# EAGLE design Adapter Board (EAGLE 7.1.0)
eDP video adapter board
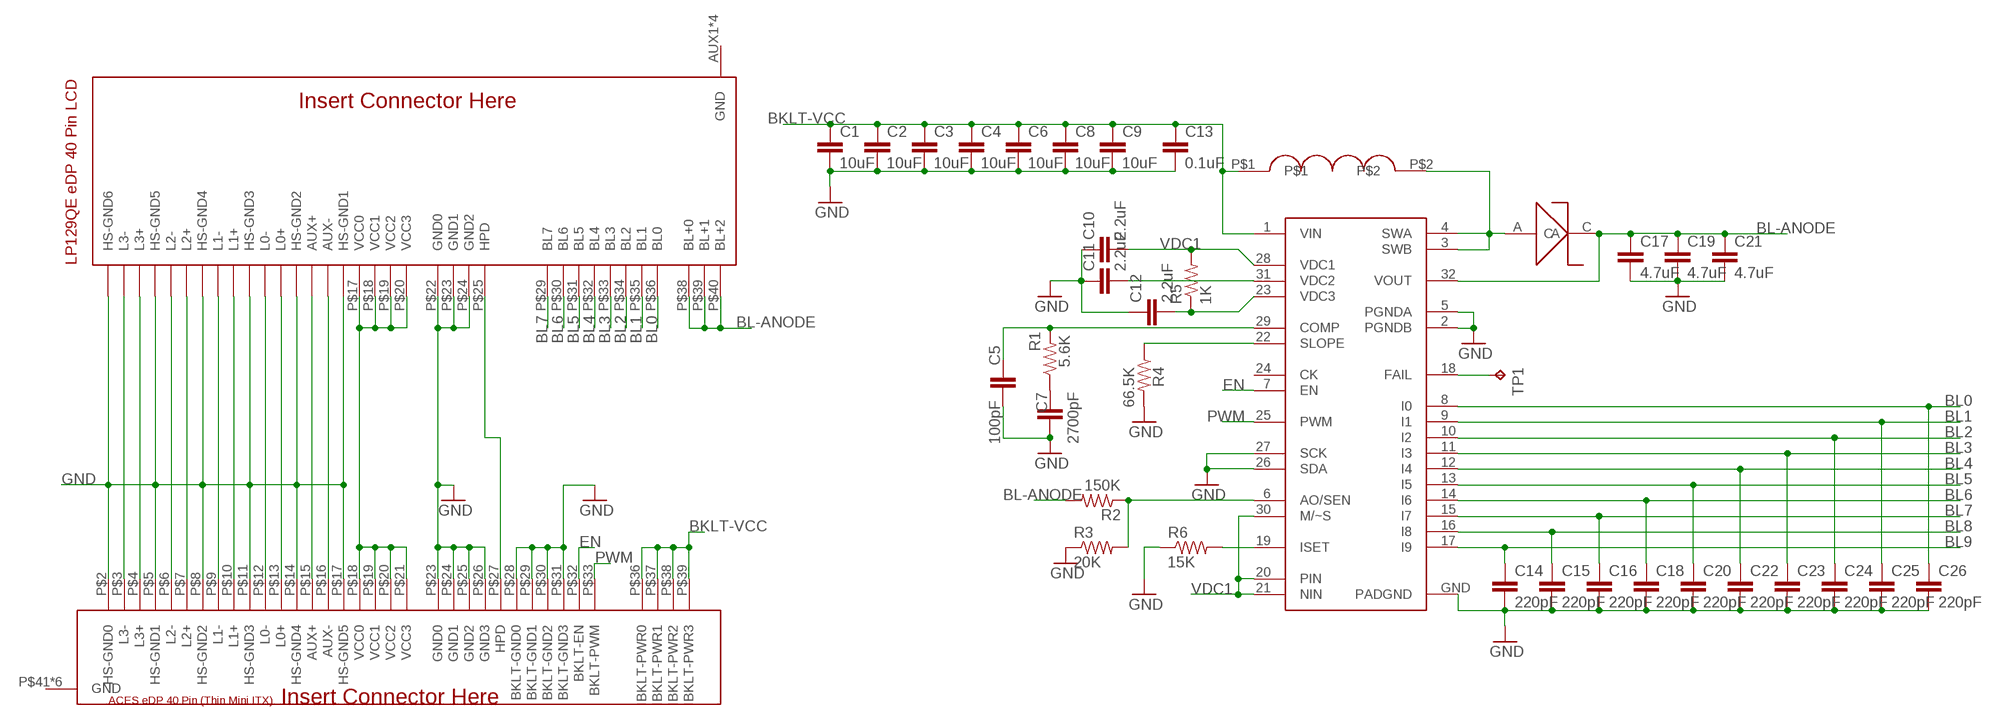
[diagram p0: schematic, sheet 1]

## Parts
C1  10uF  10UF-6.3V-20%(1206)  [1206]
C2  10uF  10UF-6.3V-20%(1206)  [1206]
C3  10uF  10UF-6.3V-20%(1206)  [1206]
C4  10uF  10UF-6.3V-20%(1206)  [1206]
C5  100pF  CAP0805  [0805]
C6  10uF  10UF-6.3V-20%(1206)  [1206]
C7  2700pF  CAP0805  [0805]
C8  10uF  10UF-6.3V-20%(1206)  [1206]
C9  10uF  10UF-6.3V-20%(1206)  [1206]
C10  2.2uF  CAP0805  [0805]
C11  2.2uF  CAP0805  [0805]
C12  2.2uF  CAP0805  [0805]
C13  0.1uF  CAP0805  [0805]
C14  220pF  CAP0805  [0805]
C15  220pF  CAP0805  [0805]
C16  220pF  CAP0805  [0805]
C17  4.7uF  CAP0805  [0805]
C18  220pF  CAP0805  [0805]
C19  4.7uF  CAP0805  [0805]
C20  220pF  CAP0805  [0805]
C21  4.7uF  CAP0805  [0805]
C22  220pF  CAP0805  [0805]
C23  220pF  CAP0805  [0805]
C24  220pF  CAP0805  [0805]
C25  220pF  CAP0805  [0805]
C26  220pF  CAP0805  [0805]
D1  SK38A-DIODE  [SK38A-DIODE]
F1  EDP-40PIN-ACES  [ACES-50203-040]
F2  LP129QE-EDP-40  [I-PEX-20474-040E-12]
I1  ASPI-8040S-INCUCTOR  [INDUCTOR]
R1  5.6K  RESISTOR0805-RES  [0805]
R2  150K  RESISTOR0805-RES  [0805]
R3  20K  RESISTOR0805-RES  [0805]
R4  66.5K  RESISTOR0805-RES  [0805]
R5  1K  RESISTOR0805-RES  [0805]
R6  15K  RESISTOR0805-RES  [0805]
TP1  TPTP15R  [TP15R]
U1  MC34844-LED-DRIVER  [QFN32]

## Nets
BKLT-VCC: C1.1 C2.1 C3.1 C4.1 C6.1 C8.1 C9.1 C13.1 F1.P$36(BKLT-PWR0) F1.P$37(BKLT-PWR1) F1.P$38(BKLT-PWR2) F1.P$39(BKLT-PWR3) I1.P$1 U1.1(VIN)
BL0: C26.1 F2.P$36(BL0) U1.8(I0)
BL1: C25.1 F2.P$35(BL1) U1.9(I1)
BL2: C24.1 F2.P$34(BL2) U1.10(I2)
BL3: C23.1 F2.P$33(BL3) U1.11(I3)
BL4: C22.1 F2.P$32(BL4) U1.12(I4)
BL5: C20.1 F2.P$31(BL5) U1.13(I5)
BL6: C18.1 F2.P$30(BL6) U1.14(I6)
BL7: C16.1 F2.P$29(BL7) U1.15(I7)
BL8: C15.1 U1.16(I8)
BL9: C14.1 U1.17(I9)
BL-ANODE: C17.1 C19.1 C21.1 D1.C F2.P$38(BL+0) F2.P$39(BL+1) F2.P$40(BL+2) R2.2 U1.32(VOUT)
EN: F1.P$32(BKLT-EN) U1.7(EN)
GND: C1.2 C2.2 C3.2 C4.2 C5.2 C6.2 C7.2 C8.2 C9.2 C10.1 C11.1 C12.1 C13.2 C14.2 C15.2 C16.2 C17.2 C18.2 C19.2 C20.2 C21.2 C22.2 C23.2 C24.2 C25.2 C26.2 F1.P$2(HS-GND0) F1.P$5(HS-GND1) F1.P$8(HS-GND2) F1.P$11(HS-GND3) F1.P$14(HS-GND4) F1.P$17(HS-GND5) F1.P$23(GND0) F1.P$24(GND1) F1.P$25(GND2) F1.P$26(GND3) F1.P$28(BKLT-GND0) F1.P$29(BKLT-GND1) F1.P$30(BKLT-GND2) F1.P$31(BKLT-GND3) F2.P$1(HS-GND6) F2.P$4(HS-GND5) F2.P$7(HS-GND4) F2.P$10(HS-GND3) F2.P$13(HS-GND2) F2.P$16(HS-GND1) F2.P$22(GND0) F2.P$23(GND1) F2.P$24(GND2) R3.1 R4.2 R6.1 U1.2(PGNDB) U1.5(PGNDA) U1.26(SDA) U1.27(SCK) U1.GND(PADGND)
HPD: F1.P$27(HPD) F2.P$25(HPD)
N$1: C5.1 R1.2 U1.29(COMP)
N$2: F1.P$3(L3-) F2.P$2(L3-)
N$3: F1.P$4(L3+) F2.P$3(L3+)
N$4: C11.2 U1.31(VDC2)
N$5: F1.P$6(L2-) F2.P$5(L2-)
N$6: F1.P$7(L2+) F2.P$6(L2+)
N$8: F1.P$9(L1-) F2.P$8(L1-)
N$9: F1.P$10(L1+) F2.P$9(L1+)
N$10: C12.2 R5.1 U1.23(VDC3)
N$11: F1.P$12(L0-) F2.P$11(L0-)
N$12: F1.P$13(L0+) F2.P$12(L0+)
N$13: C7.1 R1.1
N$14: F1.P$15(AUX+) F2.P$14(AUX+)
N$15: F1.P$16(AUX-) F2.P$15(AUX-)
N$16: R2.1 R3.2 U1.6(AO/SEN)
N$17: R4.1 U1.22(SLOPE)
N$18: TP1.TP U1.18(FAIL)
N$20: R6.2 U1.19(ISET)
PNL-VCC: F1.P$18(VCC0) F1.P$19(VCC1) F1.P$20(VCC2) F1.P$21(VCC3) F2.P$17(VCC0) F2.P$18(VCC1) F2.P$19(VCC2) F2.P$20(VCC3)
PWM: F1.P$33(BKLT-PWM) U1.25(PWM)
SWA/B: D1.A I1.P$2 U1.3(SWB) U1.4(SWA)
VDC1: C10.2 R5.2 U1.20(PIN) U1.21(NIN) U1.28(VDC1) U1.30(M/~S)
Unconnected: U1.24(CK)

## Power pins joined to a net without a drawn wire
GND: F1.P$41(GND) F1.P$42(GND) F1.P$43(GND) F1.P$44(GND) F1.P$45(GND) F1.P$46(GND) F2.AUX1(GND) F2.AUX2(GND) F2.GND-PAD1(GND) F2.GND-PAD2(GND)

## Library data of the parts
C1-C4 C6 C8 C9 = SparkFun-Capacitors:10UF-6.3V-20%(1206): Ceramic CAP-10057; PROD_ID: CAP-10057
C5 C7 C10-C13 C17 C19 C21 = SparkFun-Capacitors:CAP: Capacitor Standard 0603 ceramic capacitor, and 0.1" leaded capacitor.
C14-C16 C18 C20 C22-C26 = SparkFun-Passives:CAP: Capacitor Standard 0603 ceramic capacitor, and 0.1" leaded capacitor.
D1 = LCD Connectors:SK38A-DIODE
F1 = LCD Connectors:EDP-40PIN-ACES
F2 = LCD Connectors:LP129QE-EDP-40
I1 = LCD Connectors:ASPI-8040S-INCUCTOR
R1-R6 = SparkFun-Resistors:RESISTOR: Resistor Basic schematic elements and footprints for 0603, 1206, and PTH resistors.
TP1 = testpad:TP: Test pad
U1 = LCD Connectors:MC34844-LED-DRIVER

## Board
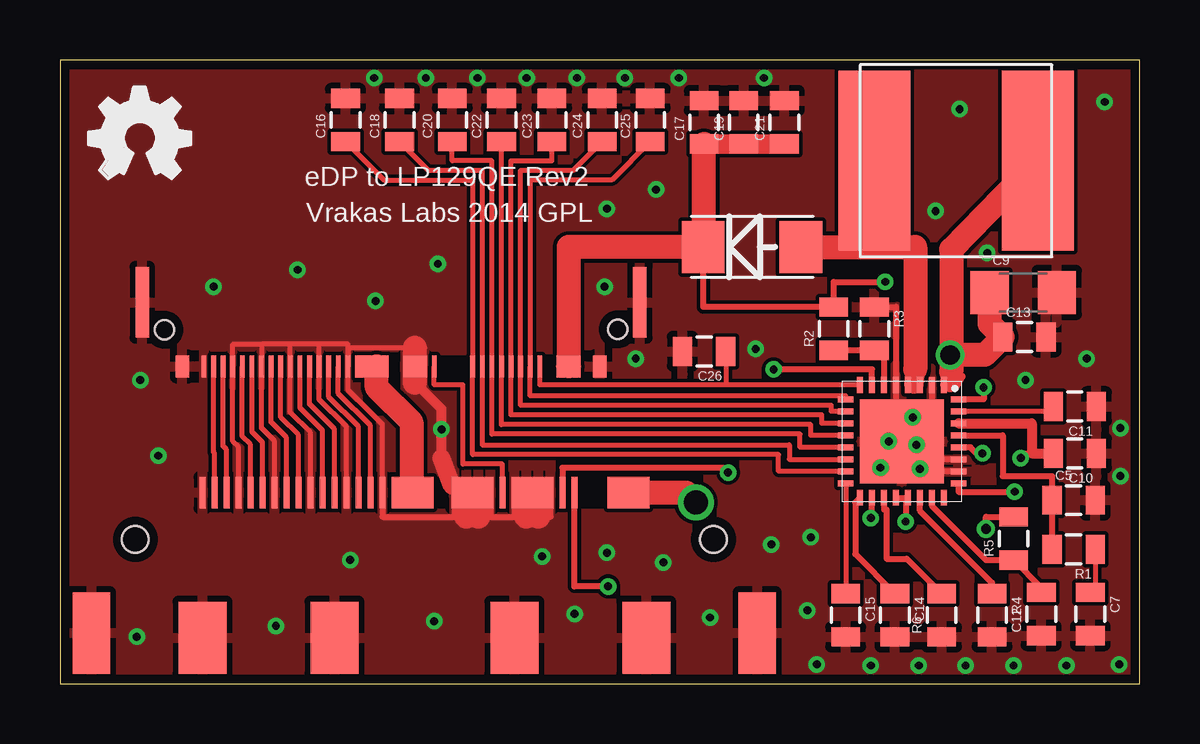
[diagram p1: board, top side]
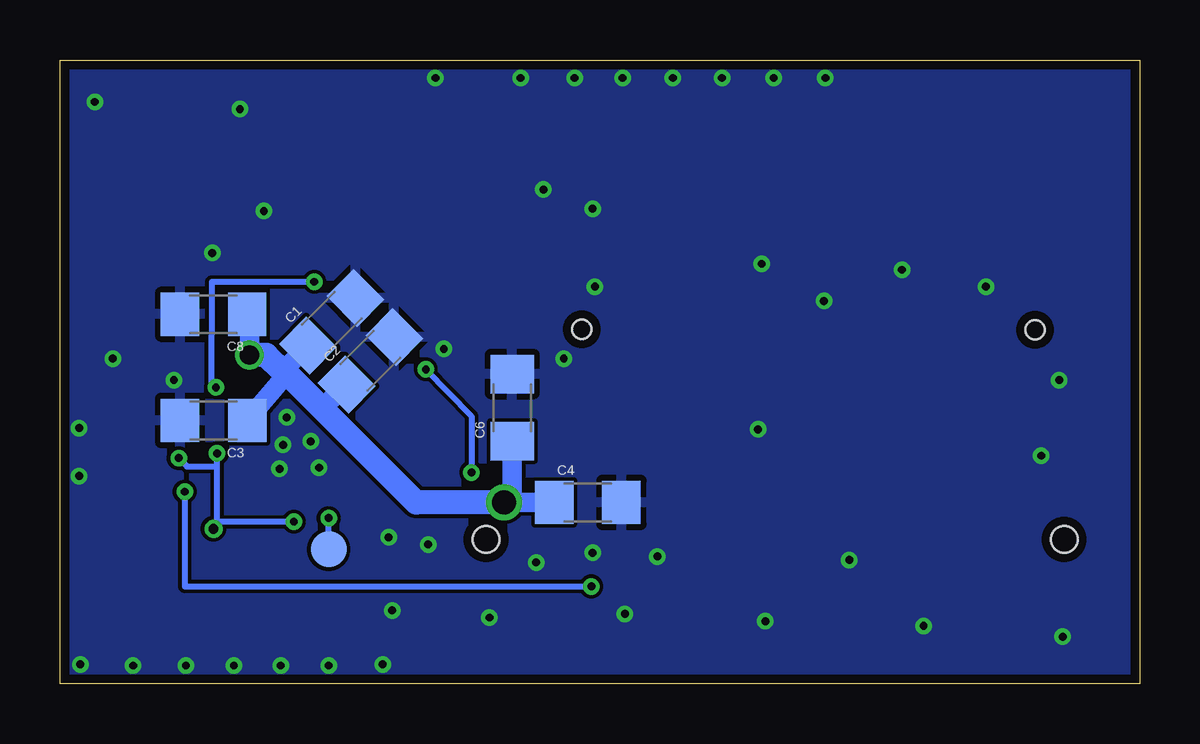
[diagram p2: board, bottom side, seen from below]

Size 45 x 26 mm. Coordinates in mm from the lower left corner, seen from the top.
Outline: 0,0 45,0 45,26 0,26 0,0
Copper layers (1*16): Top 0.0356mm / dielectric 1.5011mm / Bottom 0.0356mm
Design rules "oshpark-2layer": minimum track width 6mil, minimum drill 13mil, track to track 6mil, track to pad 6mil, pad to pad 6mil, via to via 6mil, smd to smd 6mil, copper to edge 15mil, drill to drill 6mil, minimum pad ring 7mil, minimum via ring 7mil, stop-mask expansion 4mil, vias tented up to drill 0mil, thermal gap 10mil

### Footprints (pad centres in the part's own frame; a part is rotated, then mirrored left to right if it is on the bottom)
1206 = smd 1.6 x 1.8: 1 -1.4,0; 2 1.4,0
0805 = smd 0.8 x 1.2: 1 -0.9,0; 2 0.9,0
SK38A-DIODE = smd 1.778 x 2.159: A -2.032,0; C 2.032,0
ACES-50203-040 = smd 0.25 x 1.3: P$2 -9.25,-0.65; P$3 -8.75,-0.65; P$4 -8.25,-0.65; P$5 -7.75,-0.65; P$6 -7.25,-0.65; P$7 -6.75,-0.65; P$8 -6.25,-0.65; P$9 -5.75,-0.65; P$10 -5.25,-0.65; P$11 -4.75,-0.65; P$12 -4.25,-0.65; P$13 -3.75,-0.65; P$14 -3.25,-0.65; P$15 -2.75,-0.65; P$16 -2.25,-0.65; P$17 -1.75,-0.65; P$18 -1.25,-0.65; P$21 0.25,-0.65; P$23 1.25,-0.65; P$26 2.75,-0.65; P$27 3.25,-0.65; P$28 3.75,-0.65; P$31 5.25,-0.65; P$32 5.75,-0.65; P$33 6.25,-0.65; P$36 7.75,-0.65; P$39 9.25,-0.65 | smd 1.25 x 1.3: P$19 -0.75,-0.65; P$20 -0.25,-0.65; P$24 1.75,-0.65; P$25 2.25,-0.65; P$29 4.25,-0.65; P$30 4.75,-0.65; P$37 8.25,-0.65; P$38 8.75,-0.65 | smd 1.55 x 3.4: P$41 -13.875,-6.5; P$42 13.875,-6.5 | smd 2 x 3: P$43 -9.25,-6.7; P$44 -3.75,-6.7; P$45 3.75,-6.7; P$46 9.25,-6.7 | hole 1.1: 12.05,-2.6; -12.05,-2.6
I-PEX-20474-040E-12 = smd 0.55 x 0.9: AUX1 0.8,0; AUX2 -16.6,0 | smd 0.56 x 2.95: GND-PAD1 -18.27,-2.675; GND-PAD2 2.47,-2.675 | smd 0.2 x 0.9: P$1 -0.1,0; P$2 -0.5,0; P$3 -0.9,0; P$4 -1.3,0; P$5 -1.7,0; P$6 -2.1,0; P$7 -2.5,0; P$8 -2.9,0; P$9 -3.3,0; P$10 -3.7,0; P$11 -4.1,0; P$12 -4.5,0; P$13 -4.9,0; P$14 -5.3,0; P$15 -5.7,0; P$16 -6.1,0; P$17 -6.5,0; P$20 -7.7,0; P$22 -8.5,0; P$24 -9.3,0; P$25 -9.7,0; P$29 -11.3,0; P$30 -11.7,0; P$31 -12.1,0; P$32 -12.5,0; P$33 -12.9,0; P$34 -13.3,0; P$35 -13.7,0; P$36 -14.1,0; P$38 -14.9,0; P$40 -15.7,0 | smd 1 x 0.9: P$18 -6.9,0; P$19 -7.3,0; P$23 -8.9,0; P$39 -15.3,0 | hole 0.8: 1.55,-1.53; -17.35,-1.55
INDUCTOR = smd 3 x 7.5: P$1 3.4,0; P$2 -3.4,0
TP15R = smd 1.5 x 1.5: TP 0,0
QFN32 = smd 0.65 x 0.25: 1 -2.35,1.75; 2 -2.35,1.25; 3 -2.35,0.75; 4 -2.35,0.25; 5 -2.35,-0.25; 6 -2.35,-0.75; 7 -2.35,-1.25; 8 -2.35,-1.75; 17 2.35,-1.75; 18 2.35,-1.25; 19 2.35,-0.75; 20 2.35,-0.25; 21 2.35,0.25; 22 2.35,0.75; 23 2.35,1.25; 24 2.35,1.75 | smd 0.25 x 0.65: 9 -1.75,-2.35; 10 -1.25,-2.35; 11 -0.75,-2.35; 12 -0.25,-2.35; 13 0.25,-2.35; 14 0.75,-2.35; 15 1.25,-2.35; 16 1.75,-2.35; 25 1.75,2.35; 26 1.25,2.35; 27 0.75,2.35; 28 0.25,2.35; 29 -0.25,2.35; 30 -0.75,2.35; 31 -1.25,2.35; 32 -1.75,2.35 | smd 3.5 x 3.5: GND 0,0

### Placement (x,y rotation side)
C1  33.67,15.09 45 bottom
C2  32.06,13.46 45 bottom
C3  38.59,10.97 180 bottom
C4  23,7.55 0 bottom
C5  42.25,7.65 0 top
C6  26.15,11.5 90 bottom
C7  42.95,2.9 270 top
C8  38.6,15.4 180 bottom
C9  40.15,16.3 0 top
C10  42.3,9.6 180 top
C11  42.3,11.55 180 top
C12  40.9,2.9 90 top
C13  40.2,14.45 0 top
C14  34.8,2.85 270 top
C15  32.75,2.85 270 top
C16  11.9,23.5 90 top
C17  26.85,23.4 90 top
C18  14.15,23.5 90 top
C19  28.5,23.4 90 top
C20  16.35,23.5 90 top
C21  30.2,23.4 90 top
C22  18.4,23.5 90 top
C23  20.5,23.5 90 top
C24  22.6,23.5 90 top
C25  24.6,23.5 90 top
C26  26.85,13.85 180 top
D1  28.85,18.2 180 top
F1  15.19,8.61 0 top
F2  5.9,13.22 180 top
I1  37.35,21.8 0 top
R1  42.25,5.6 180 top
R2  32.25,14.8 90 top
R3  33.95,14.8 270 top
R4  38.85,2.85 270 top
R5  39.75,6.05 90 top
R6  36.75,2.85 90 top
TP1  33.8,5.6 0 bottom
U1  35.1,10.1 270 top
U$5  [OSHW_FILLX150_NOTEXT]  1.2,21.05 0 top

### Tracks (layer width: path | path; a pad name or v marks a point on that pad's centre or on a via)
BKLT-VCC  (via drill 0.8, 1)
  Top 0.2: F1.P$36 F1.P$37 F1.P$38 F1.P$39
  Top 0.305: 37.6,12.8 37.33,12.32 37.15,13 36.95,12.8 U1.1
  Top 0.8: v37.1,13.7 37.1,12.55 37.15,13
  Top 0.813: 23.95,7.8 24.05,7.9 24.1,7.9 24.05,7.95 23.25,7.95 23.26,7.96 F1.P$38 24.54,7.95
  Top 1: I1.P$1 37.15,18.1 37.15,13 | v26.5,7.55 26.1,7.95 24.54,7.95 | v37.1,13.7 38.55,13.7 C13.1 38.75,15 C9.1
  Bottom 0.813: C2.1 34.08,11.47 | C1.1 35.73,13.03 35.52,12.93 C3.1 | C4.1 26.15,7.55 | 26.15,7.55 v26.5,7.55 | C6.1 26.15,7.55 | C8.1 37.1,15.4 v37.1,13.7
  Bottom 1: v26.5,7.55 30.15,7.55 34.08,11.47 35.52,12.93 | 35.73,13.03 36.4,13.7 v37.1,13.7
BL0
  Top 0.2: U1.8 27.75,12.45 | 27.75,12.45 20,12.45 F2.P$36 | C26.1 27.75,12.45
BL1
  Top 0.2: U1.9 32.75,12 19.6,12 F2.P$35 19.6,21 23,21 C25.1
BL2
  Top 0.2: U1.10 32.15,11.35 32.15,11.6 19.2,11.6 F2.P$34 19.2,21.4 21.4,21.4 C24.1
BL3
  Top 0.2: U1.11 31.75,10.85 31.75,11.2 18.8,11.2 F2.P$33 18.8,21.8 20.5,21.8 C23.1
BL4
  Top 0.2: U1.12 31.3,10.35 31.3,10.8 18.4,10.8 F2.P$32 C22.1
BL5
  Top 0.2: U1.13 30.85,9.85 30.85,10.4 18,10.4 F2.P$31 18,21.8 16.35,21.8 C20.1
BL6
  Top 0.2: U1.14 30.4,9.35 30.4,9.95 17.6,9.95 F2.P$30 17.6,21.4 15.35,21.4 C18.1
BL7
  Top 0.2: U1.15 29.95,8.85 29.95,9.55 17.2,9.55 F2.P$29 17.2,21 13.5,21 C16.1
BL8
  Top 0.2: U1.16 C15.1
BL9
  Top 0.254: U1.17 33.15,7.55 33.15,5.4 C14.1
BL-ANODE  (via drill 0.33)
  Top 0.254: F2.P$38 F2.P$39 F2.P$40 | D1.C 26.82,15.7 R2.2 32.25,16.75 v34.4,16.75 | v38.5,12.35 38.5,11.85 U1.32
  Top 0.813: C17.1 C19.1 C21.1
  Top 1: F2.P$39 21.2,18.2 D1.C 26.85,18.2 C17.1
  Bottom 0.254: v34.4,16.75 38.67,16.75 38.7,12.35 v38.5,12.35
EN  (via drill 0.33)
  Top 0.254: U1.7 33.85,13.1 v29.75,13.1 | v27.85,8.8 27.65,9 20.95,9 20.94,8.99 F1.P$32
  Bottom 0.254: v29.75,13.1 27.85,11.15 v27.85,8.8
GND  (via drill 0.33)
  Top 0.2: F1.P$17 13.44,10.81 12,12.25 F2.P$16 | F2.P$22 14.4,14 | 14.4,14 12,14 F2.P$16 | F2.P$23 14.8,13.75 | 14.4,14 14.8,14 15.2,14 F2.P$24 | 8.4,14.15 7.2,14.15 F2.P$4 7.2,10.1 7.44,9.86 F1.P$5 | 8.4,14.15 F2.P$7 8.4,10.65 8.94,10.11 F1.P$8 | 9.6,14.15 F2.P$10 9.6,11.3 10.44,10.46 F1.P$11 | 9.6,14.15 8.4,14.15 | 10.8,14.15 F2.P$13 10.8,11.85 11.94,10.71 F1.P$14 | 10.8,14.15 9.6,14.15 | F2.P$16 12,14.15 10.8,14.15
  Top 0.254: F1.P$25 F1.P$24 F1.P$23 16.44,6.95 | 16.44,6.95 16.94,6.95 17.44,6.95 17.94,6.95 | 17.94,6.95 18.94,6.95 | 18.94,6.95 19.44,6.95 19.94,6.95 20.45,6.95 F1.P$31 | F1.P$28 18.94,6.95 | F1.P$26 17.94,6.95 | F1.P$17 13.44,6.95 16.44,6.95 | U1.27 35.85,9.35 arc-90 U1.GND | U1.GND arc-90 34.85,10.35 U1.5 34.85,15.7 R3.1 | U1.2 36.35,10.1 U1.GND | U1.26 36.35,8.85 arc-90 U1.GND
  Top 0.406: 17,7.95 16.45,8.25 16.35,8.25 | 15.9,9.4 15.9,11.45 14.8,12.55
  Top 0.75: 16.35,8.25 15.9,9.4
  Top 1: F1.P$30 19.94,6.95 | F1.P$29 19.44,6.95 | F1.P$24 16.94,6.95 | F1.P$25 17.44,6.95 | 14.8,14 14.8,13.75 14.8,12.55
  other vias: 9.9,17.25 15.75,17.5 29,13.95 38.65,17.95 31.55,0.8 44.2,8.65 29.35,25.25 13.15,15.95 25.8,25.25 21.45,2.9 37.75,0.75 42.8,13.55 40.25,12.65 44.2,10.65 44.15,0.8 39.75,0.75 24,13.55 22.7,16.55 24.85,20.6 36.5,19.7 15.6,2.6 3.2,1.95 3.35,12.65 6.4,16.55 22.8,19.8 37.5,23.95 43.55,24.25 41.95,0.75 27.1,2.75 9,2.4 4.1,9.5 12.1,5.15 31.15,3.05 13.1,25.25 15.25,25.25 19.45,25.25 23.55,25.25 17.4,25.25 21.55,25.25 15.9,10.6 29.65,5.8 33.8,0.75 35.8,0.75 20.1,5.3 22.8,5.45 31.3,6.1 35.55,11.1 34.55,10.1 34.2,9 35.85,8.95 35.7,9.95 25.15,5.05
  pour Top: -2.05,-4.65 -2.05,29.2 53.4,29.2 53.4,-4.65
  pour Bottom: -3.25,29.95 -3.25,-6.3 57.95,-6.3 57.95,29.95
HPD
  Top 0.2: F1.P$27 18.44,9.15 16.8,9.15 16.8,12.45 15.6,12.45 F2.P$25
N$1
  Top 0.25: 41.35,8.65 C5.1 R1.2
  Top 0.254: U1.29 39.3,10.35 39.3,8.65 41.35,8.65
N$2
  Top 0.2: F1.P$3 6.44,9.61 6.4,9.65 F2.P$2
N$3
  Top 0.2: F1.P$4 6.94,9.76 6.8,9.9 F2.P$3
N$4
  Top 0.2: C11.2 41.35,11.55 41.35,11.35 U1.31
N$5
  Top 0.2: F1.P$6 7.94,9.96 7.6,10.3 F2.P$5
N$6
  Top 0.2: F1.P$7 8.44,10.06 8,10.5 F2.P$6
N$8
  Top 0.2: F1.P$9 9.44,10.26 8.8,10.9 F2.P$8
N$9
  Top 0.2: F1.P$10 9.94,10.36 9.2,11.1 F2.P$9
N$10
  Top 0.254: U1.23 36.35,7.4 38.6,5.15 R5.1 40.9,4 C12.2
N$11
  Top 0.2: F1.P$12 10.94,10.56 10,11.5 F2.P$11
N$12
  Top 0.2: F1.P$13 11.44,10.61 10.4,11.65 F2.P$12
N$13
  Top 0.2: R1.1 43.15,3.8 C7.1
N$14
  Top 0.2: F1.P$15 12.44,10.71 11.2,11.95 F2.P$14
N$15
  Top 0.2: F1.P$16 12.94,10.76 11.6,12.1 F2.P$15
N$16
  Top 0.254: R2.1 R3.2 34.35,13.8 U1.6
N$17
  Top 0.254: R4.1 38.85,4.2 35.85,7.2 U1.22
N$18  (via drill 0.33)
  Top 0.254: v33.8,6.9 33.85,6.9 U1.18
  Bottom 0.254: TP1.TP v33.8,6.9
N$20
  Top 0.254: U1.19 34.35,7.25 34.45,7.25 34.45,5.2 35.3,5.2 R6.2
PNL-VCC
  Top 0.2: F1.P$20 F1.P$19 F1.P$18 | F2.P$17 F2.P$18 | F2.P$19 F2.P$20 | 14.9,8 F1.P$20 | F1.P$20 F1.P$21
  Top 0.305: 14.65,8.17 F1.P$19
  Top 0.406: F2.P$18 F2.P$19 | F1.P$19 14.48,8 14.9,8
  Top 1: 14.65,8.17 14.65,10.9 13.2,12.35 F2.P$19
PWM  (via drill 0.33)
  Top 0.254: U1.25 37.45,8 v39.8,8 | v22.85,4.05 21.44,4.05 F1.P$33
  Bottom 0.254: v39.8,8 39.8,4.05 v22.85,4.05
SWA/B
  Top 0.254: 35.6,12.5 35.35,12.25 | 35.35,12.25 U1.4 35.35,12.65 | U1.3 35.85,12.25 35.35,12.25
  Top 0.813: 35.65,13.1 35.6,12.5
  Top 1: D1.A 33.95,18.2 | 33.95,18.2 I1.P$2 | 33.95,18.2 35.65,18.2 35.65,13.1
VDC1  (via drill 0.33, 0.4)
  Top 0.254: U1.20 35.25,7.75 | U1.21 35.25,7.75 | 35.25,7.75 v35.25,6.75 | v38.45,9.6 38.2,9.6 37.95,9.85 U1.28 | v40.05,9.4 40.05,9.6 40.5,9.6 | v38.6,6.45 38.6,6.95 R5.2
  Top 0.406: U1.30 40.5,10.85 40.5,9.6 C10.2
  Bottom 0.254: v35.25,6.75 38.45,6.75 | 38.45,6.75 38.45,9.05 | 38.45,9.05 v38.45,9.6 | v40.05,9.4 39.7,9.05 38.45,9.05 | v38.6,6.45 38.45,6.75

### Text on the board
tPlace: eDP to LP129QE Rev2 | Vrakas Labs 2014 GPL